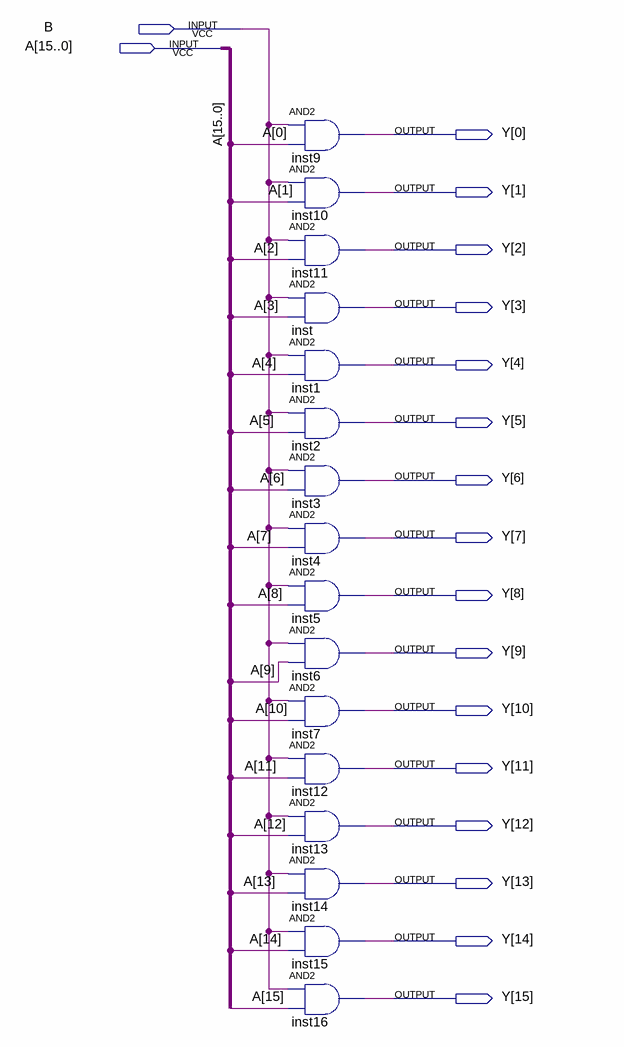
[diagram p0: schematic sheet]
// Quartus schematic ADD16COMB.bdf as structural Verilog: 16 symbols, 18 pins
module ADD16COMB (
  input  B,
  input  [15:0] A,
  output [15:0] Y
);

  and inst9 (Y[0], B, A[0]);
  and inst10 (Y[1], B, A[1]);
  and inst11 (Y[2], B, A[2]);
  and inst (Y[3], B, A[3]);
  and inst1 (Y[4], B, A[4]);
  and inst2 (Y[5], B, A[5]);
  and inst3 (Y[6], B, A[6]);
  and inst4 (Y[7], B, A[7]);
  and inst5 (Y[8], B, A[8]);
  and inst6 (Y[9], B, A[9]);
  and inst7 (Y[10], B, A[10]);
  and inst12 (Y[11], B, A[11]);
  and inst13 (Y[12], B, A[12]);
  and inst14 (Y[13], B, A[13]);
  and inst15 (Y[14], B, A[14]);
  and inst16 (Y[15], B, A[15]);
endmodule
